# EAGLE board machine-controller (EAGLE 5.10), part 1 of 3
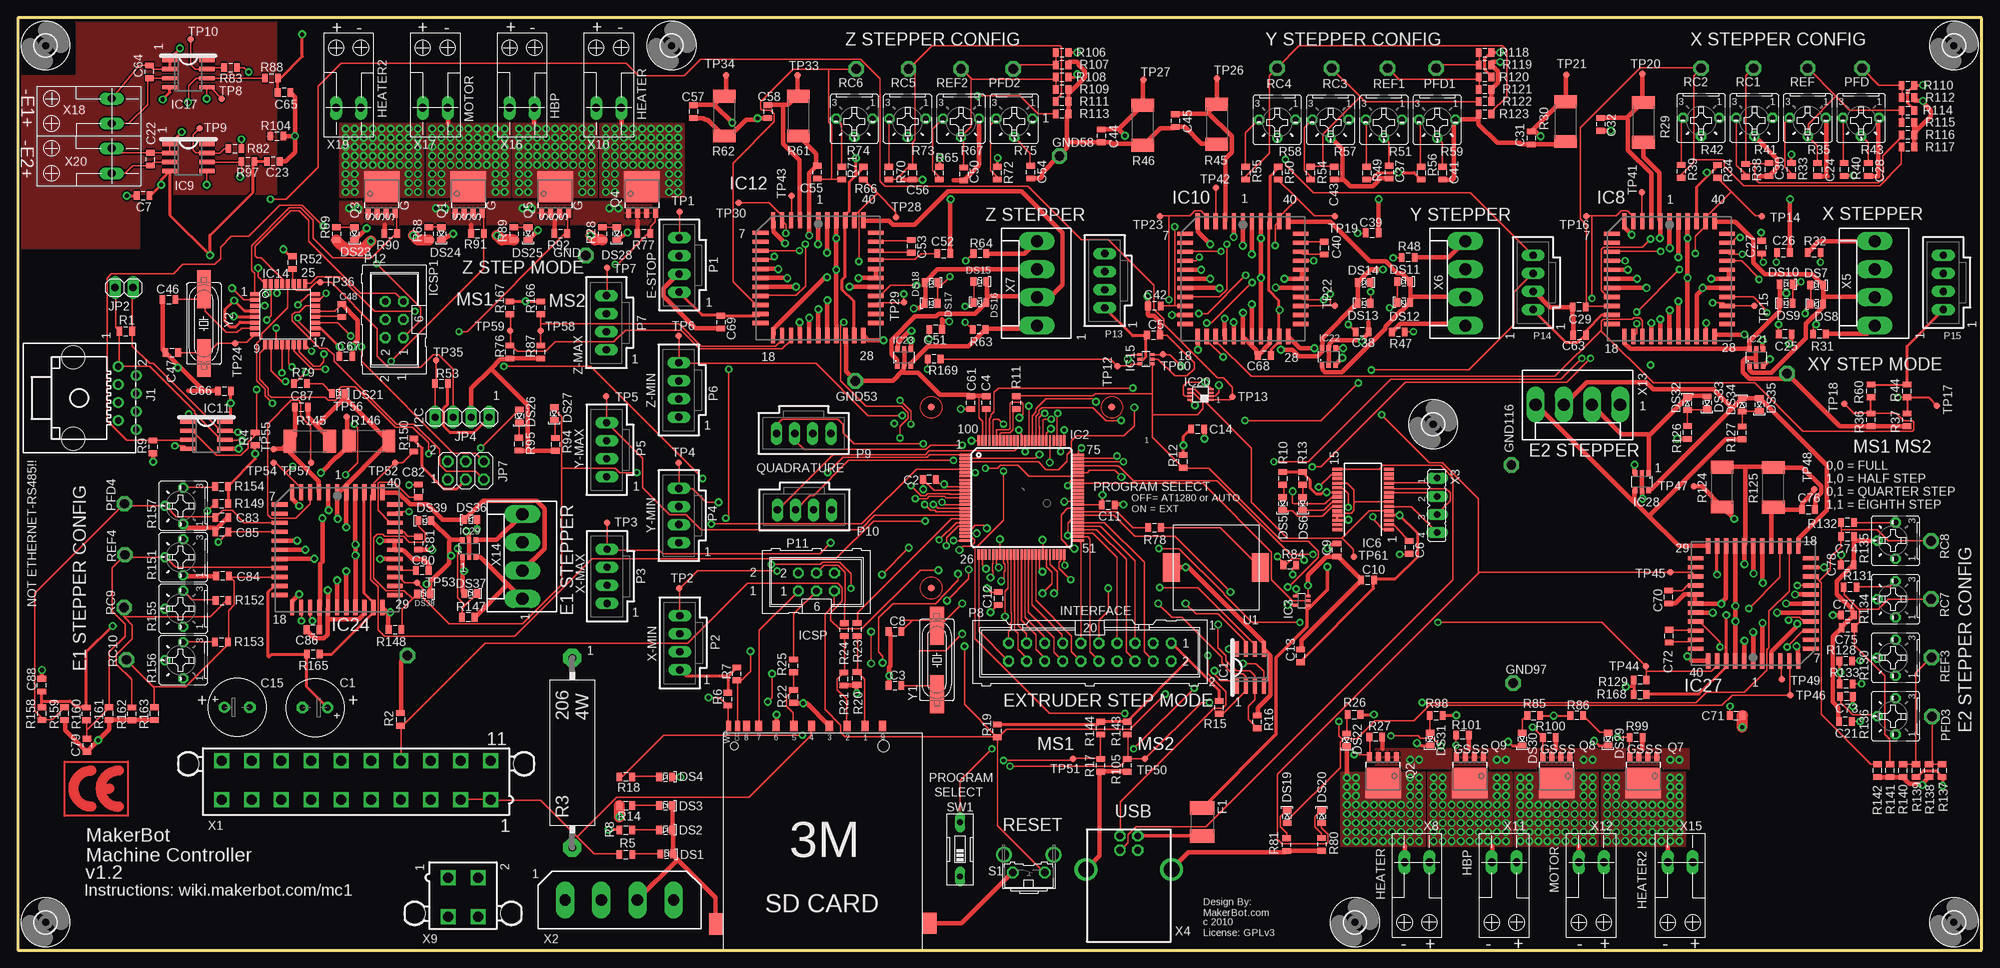
[diagram p8: board, top side]
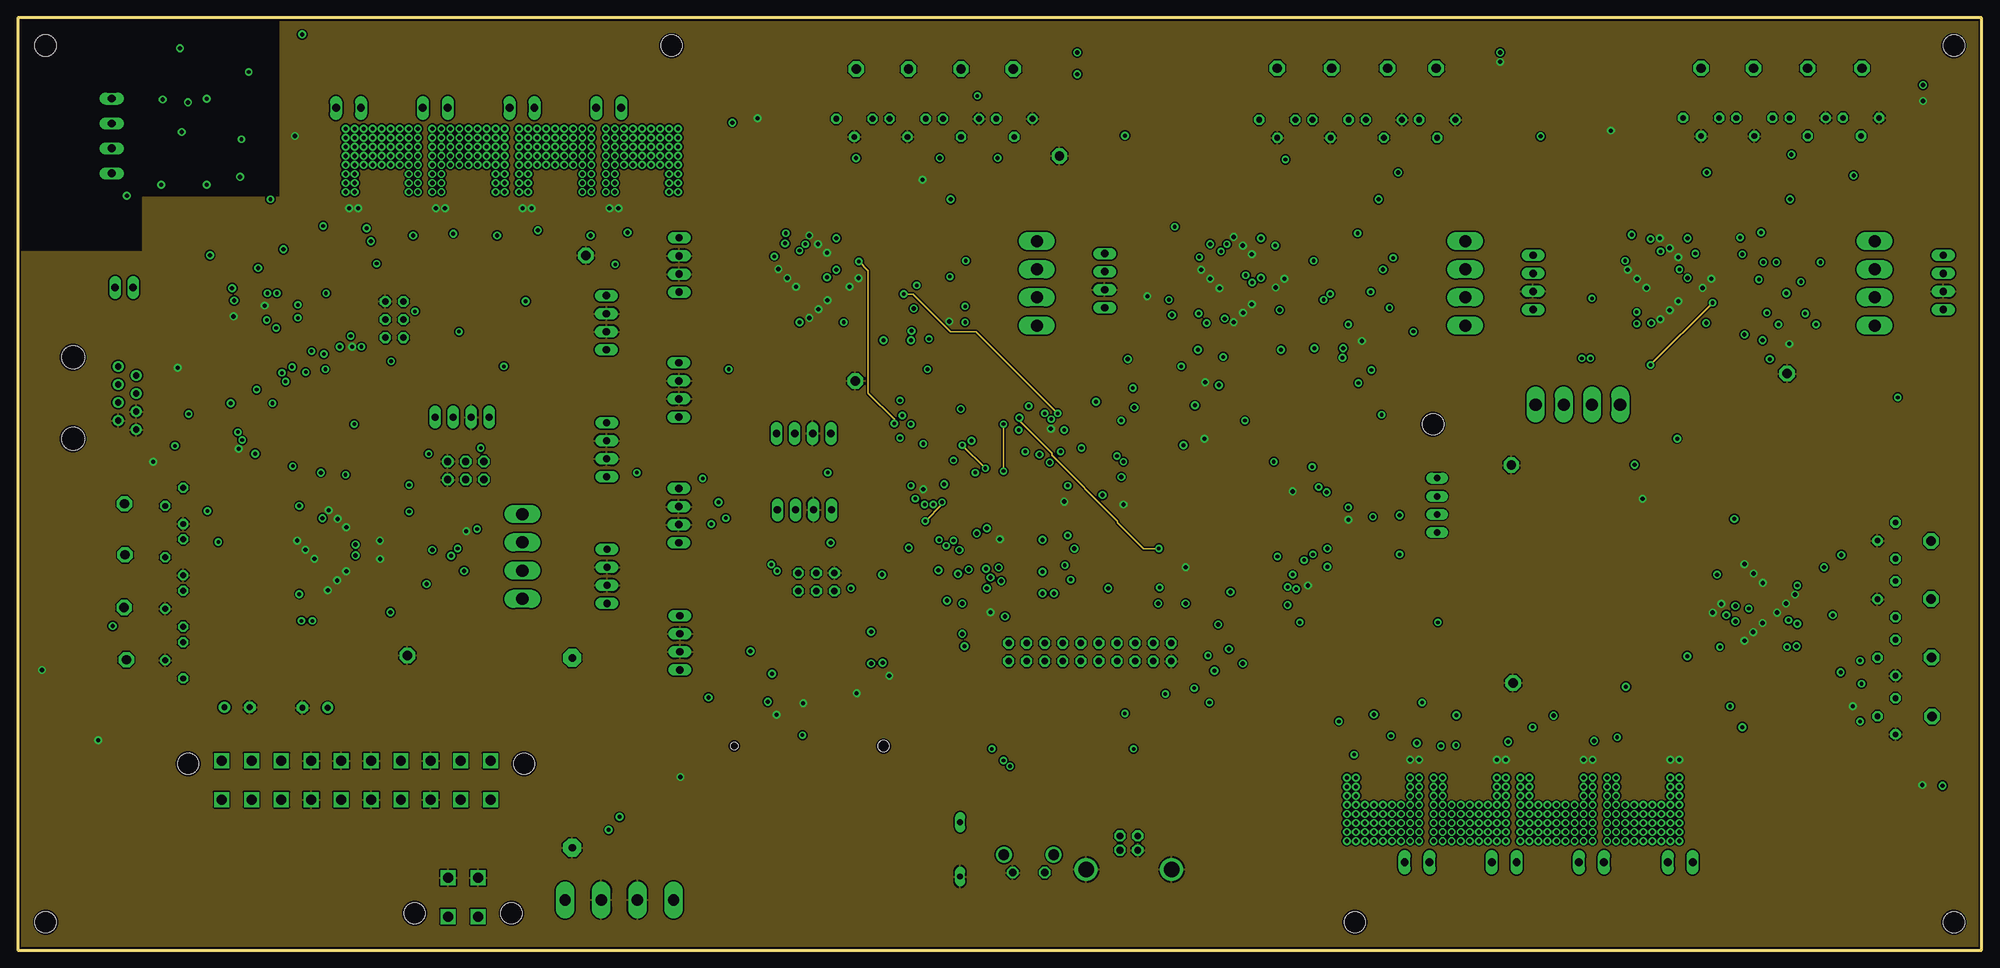
[diagram p9: board, inner layer GND]
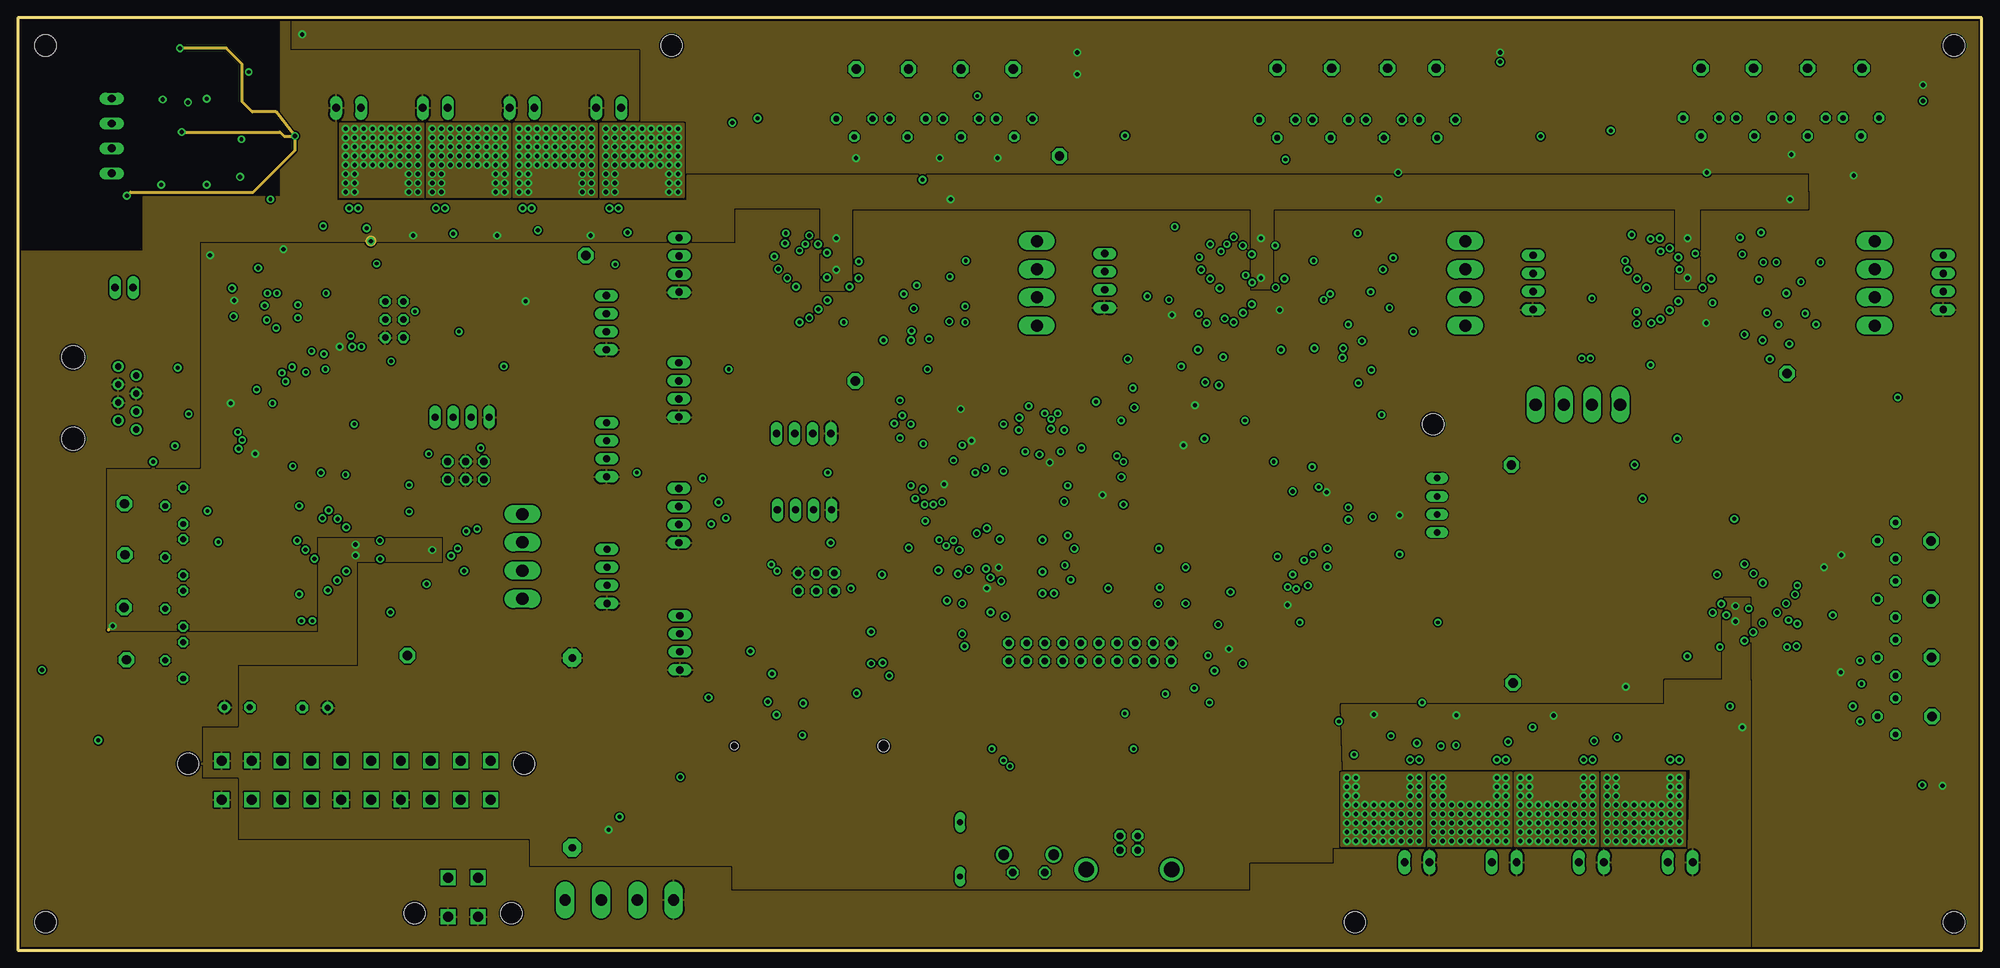
[diagram p10: board, inner layer POWER]
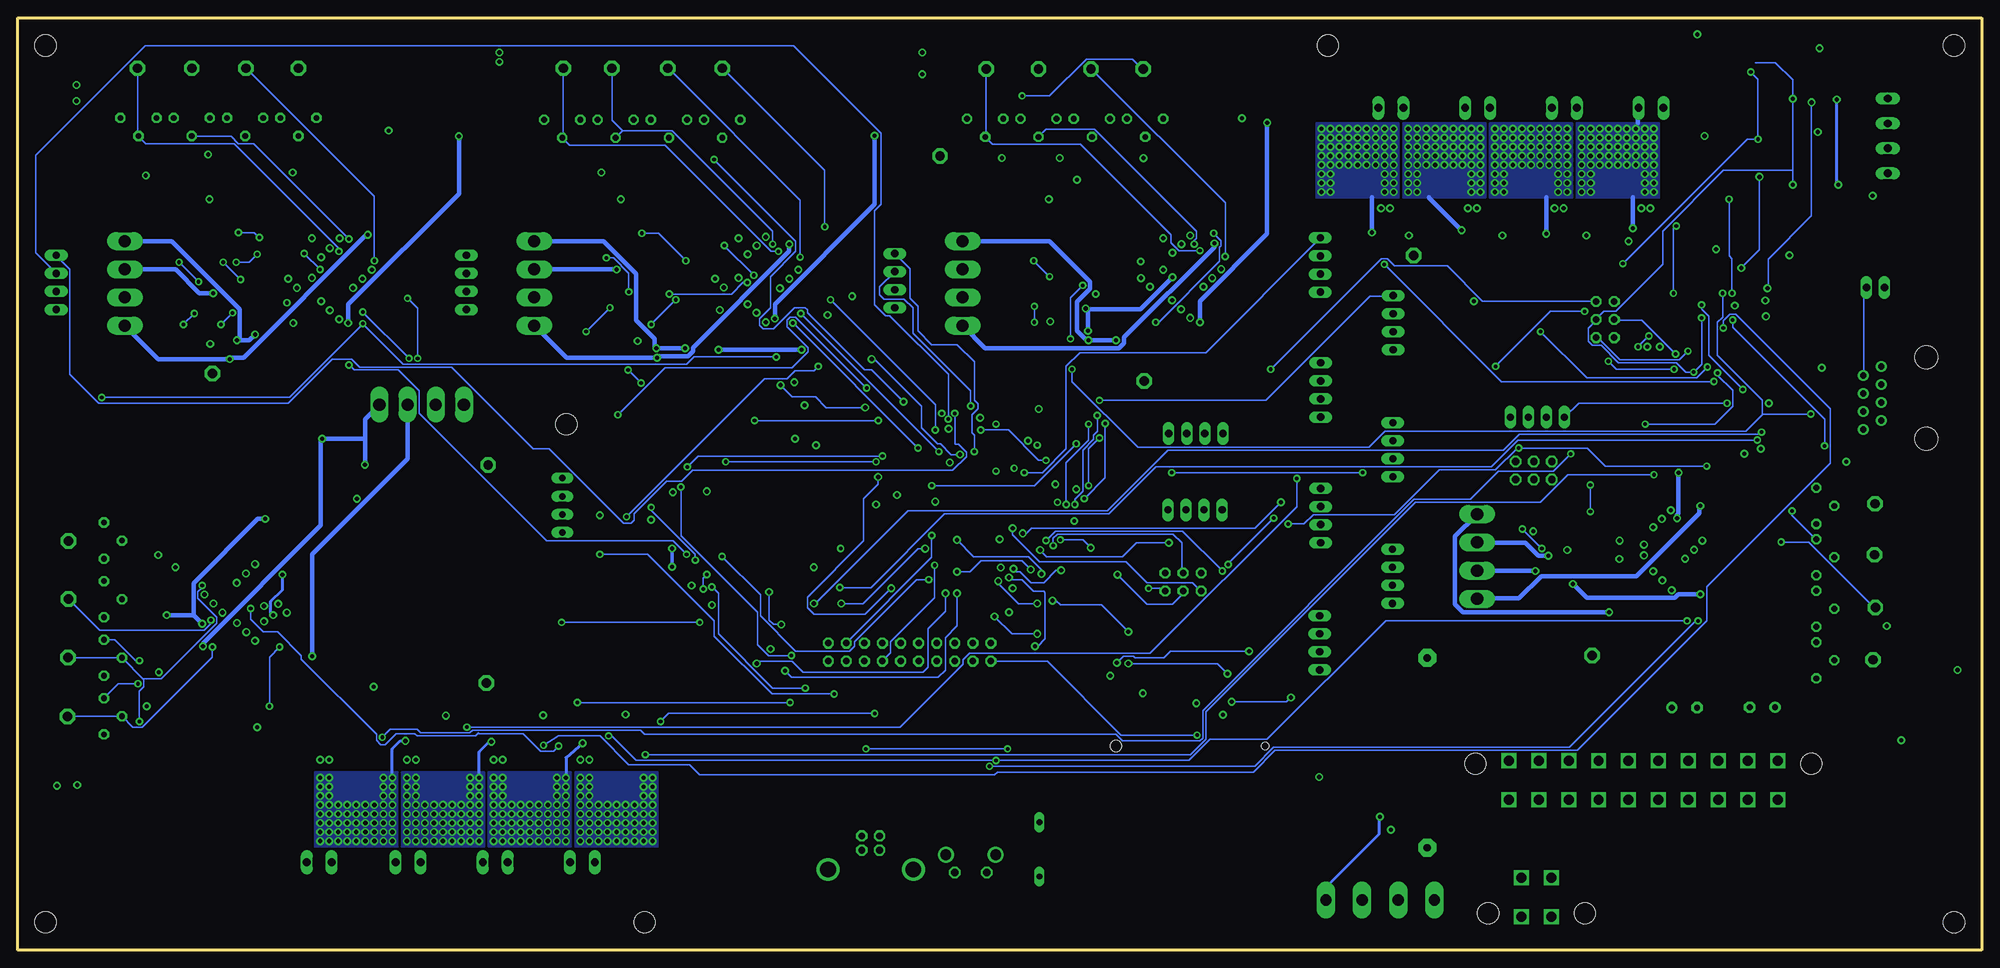
[diagram p11: board, bottom side, seen from below]

Size 276 x 131 mm. Coordinates in mm from the lower left corner, seen from the top.
Outline: 0,0 276,0 276,131 0,131 0,0
Copper layers (1*2+15*16): Top 0.035mm / dielectric 0.5mm / GND 0.035mm / dielectric 0.43mm / POWER 0.035mm / dielectric 0.5mm / Bottom 0.035mm
Design rules "SparkFun *": minimum track width 8mil, minimum drill 20mil, track to track 8mil, track to pad 8mil, pad to pad 6mil, via to via 8mil, smd to smd 6mil, copper to edge 10mil, drill to drill 8mil, minimum pad ring 12mil, minimum via ring 10mil, stop-mask expansion 3mil, vias tented up to drill 25mil, thermal gap 10mil
Net classes: 0 default: width 0.152 mm, drill 0.406 mm, clearance 0.203 mm; 1 power: width 0.61 mm, drill 0.584 mm, clearance 0.203 mm; 2 gnd: width 0.305 mm, drill 0.584 mm, clearance 0.203 mm; 3 usbvcc: width 0.508 mm, drill 0.584 mm, clearance 0.203 mm; 4 5V_power: width 0.406 mm, drill 0.584 mm, clearance 0.203 mm; 5 12V_power: width 1.524 mm, drill 0.584 mm, clearance 0.203 mm

## Footprints (pad centres in the part's own frame; a part is rotated, then mirrored left to right if it is on the bottom)
E3,5-8 = drill 0.813 pad 1.6 round: + -1.778,0 | drill 0.813 pad 1.6 octagon: - 1.778,0
0805 = smd 0.8 x 1.2: 1 -0.9,0; 2 0.9,0
LED-0805 = smd 1.2 x 0.8: A 0,-0.9; C 0,0.9
L1812 = smd 1.9 x 3.4: 1 -1.95,0; 2 1.95,0
P1-13 = drill 1.321 pad 2.159 octagon: TP 0,0
SO08 = smd 0.6 x 2.2: 1 -1.905,-2.6; 2 -0.635,-2.6; 3 0.635,-2.6; 4 1.905,-2.6; 5 1.905,2.6; 6 0.635,2.6; 7 -0.635,2.6; 8 -1.905,2.6
TQFP100 = smd 1.5 x 0.35: 1 -8,6; 2 -8,5.5; 3 -8,5; 4 -8,4.5; 5 -8,4; 6 -8,3.5; 7 -8,3; 8 -8,2.5; 9 -8,2; 10 -8,1.5; 11 -8,1; 12 -8,0.5; 13 -8,0; 14 -8,-0.5; 15 -8,-1; 16 -8,-1.5; 17 -8,-2; 18 -8,-2.5; 19 -8,-3; 20 -8,-3.5; 21 -8,-4; 22 -8,-4.5; 23 -8,-5; 24 -8,-5.5; 25 -8,-6; 51 8,-6; 52 8,-5.5; 53 8,-5; 54 8,-4.5; 55 8,-4; 56 8,-3.5; 57 8,-3; 58 8,-2.5; 59 8,-2; 60 8,-1.5; 61 8,-1; 62 8,-0.5; 63 8,0; 64 8,0.5; 65 8,1; 66 8,1.5; 67 8,2; 68 8,2.5; 69 8,3; 70 8,3.5; 71 8,4; 72 8,4.5; 73 8,5; 74 8,5.5; 75 8,6 | smd 0.35 x 1.5: 26 -6,-8; 27 -5.5,-8; 28 -5,-8; 29 -4.5,-8; 30 -4,-8; 31 -3.5,-8; 32 -3,-8; 33 -2.5,-8; 34 -2,-8; 35 -1.5,-8; 36 -1,-8; 37 -0.5,-8; 38 0,-8; 39 0.5,-8; 40 1,-8; 41 1.5,-8; 42 2,-8; 43 2.5,-8; 44 3,-8; 45 3.5,-8; 46 4,-8; 47 4.5,-8; 48 5,-8; 49 5.5,-8; 50 6,-8; 76 6,8; 77 5.5,8; 78 5,8; 79 4.5,8; 80 4,8; 81 3.5,8; 82 3,8; 83 2.5,8; 84 2,8; 85 1.5,8; 86 1,8; 87 0.5,8; 88 0,8; 89 -0.5,8; 90 -1,8; 91 -1.5,8; 92 -2,8; 93 -2.5,8; 94 -3,8; 95 -3.5,8; 96 -4,8; 97 -4.5,8; 98 -5,8; 99 -5.5,8; 100 -6,8
SC70-5 = smd 0.4 x 0.7: 1 -0.65,-0.85; 2 0,-0.85; 3 0.65,-0.85; 4 0.65,0.85; 5 -0.65,0.85
SSOP28 = smd 0.381 x 1.499: 1 -4.225,-3.625; 2 -3.575,-3.625; 3 -2.925,-3.625; 4 -2.275,-3.625; 5 -1.625,-3.625; 6 -0.975,-3.625; 7 -0.325,-3.625; 8 0.325,-3.625; 9 0.975,-3.625; 10 1.625,-3.625; 11 2.275,-3.625; 12 2.925,-3.625; 13 3.575,-3.625; 14 4.225,-3.625; 15 4.225,3.625; 16 3.575,3.625; 17 2.925,3.625; 18 2.275,3.625; 19 1.625,3.625; 20 0.975,3.625; 21 0.325,3.625; 22 -0.325,3.625; 23 -0.975,3.625; 24 -1.625,3.625; 25 -2.275,3.625; 26 -2.925,3.625; 27 -3.575,3.625; 28 -4.225,3.625
PLCC44 = smd 0.6 x 2.2: 1 0,8.1; 2 -1.27,8.1; 3 -2.54,8.1; 4 -3.81,8.1; 5 -5.08,8.1; 6 -6.35,8.1; 18 -6.35,-8.1; 19 -5.08,-8.1; 20 -3.81,-8.1; 21 -2.54,-8.1; 22 -1.27,-8.1; 23 0,-8.1; 24 1.27,-8.1; 25 2.54,-8.1; 26 3.81,-8.1; 27 5.08,-8.1; 28 6.35,-8.1; 40 6.35,8.1; 41 5.08,8.1; 42 3.81,8.1; 43 2.54,8.1; 44 1.27,8.1 | smd 2.2 x 0.6: 7 -8.1,6.35; 8 -8.1,5.08; 9 -8.1,3.81; 10 -8.1,2.54; 11 -8.1,1.27; 12 -8.1,0; 13 -8.1,-1.27; 14 -8.1,-2.54; 15 -8.1,-3.81; 16 -8.1,-5.08; 17 -8.1,-6.35; 29 8.1,-6.35; 30 8.1,-5.08; 31 8.1,-3.81; 32 8.1,-2.54; 33 8.1,-1.27; 34 8.1,0; 35 8.1,1.27; 36 8.1,2.54; 37 8.1,3.81; 38 8.1,5.08; 39 8.1,6.35
TQFP32-08 = smd 1.27 x 0.559: 1 -4.293,2.8; 2 -4.293,2; 3 -4.293,1.2; 4 -4.293,0.4; 5 -4.293,-0.4; 6 -4.293,-1.2; 7 -4.293,-2; 8 -4.293,-2.8; 17 4.293,-2.8; 18 4.293,-2; 19 4.293,-1.2; 20 4.293,-0.4; 21 4.293,0.4; 22 4.293,1.2; 23 4.293,2; 24 4.293,2.8 | smd 0.559 x 1.27: 9 -2.8,-4.293; 10 -2,-4.293; 11 -1.2,-4.293; 12 -0.4,-4.293; 13 0.4,-4.293; 14 1.2,-4.293; 15 2,-4.293; 16 2.8,-4.293; 25 2.8,4.293; 26 2,4.293; 27 1.2,4.293; 28 0.4,4.293; 29 -0.4,4.293; 30 -1.2,4.293; 31 -2,4.293; 32 -2.8,4.293
SC70-6 = smd 0.4 x 0.7: 1 -0.65,-0.85; 2 0,-0.85; 3 0.65,-0.85; 4 0.65,0.85; 5 0,0.85; 6 -0.65,0.85
DCU_R-PDSO-G8 = smd 0.3 x 0.6: 1 -0.75,-1.5; 2 -0.25,-1.5; 3 0.25,-1.5; 4 0.75,-1.5; 5 0.75,1.5; 6 0.25,1.5; 7 -0.25,1.5; 8 -0.75,1.5
SOT23-6 = smd 0.6 x 0.9: 1 -0.95,-1.15; 2 0,-1.15; 3 0.95,-1.15; 4 0.95,1.15; 5 0,1.15; 6 -0.95,1.15
556416-1 = drill 0.889 round: 1 -4.445,5.461; 2 -3.175,8.001; 3 -1.905,5.461; 4 -0.635,8.001; 5 0.635,5.461; 6 1.905,8.001; 7 3.175,5.461; 8 4.445,8.001 | hole 3.251: -5.715,-0.889; 5.715,-0.889
1X02 = drill 1.016 long: 1 -1.27,0; 2 1.27,0
1X04 = drill 1.016 long: 1 -3.81,0; 2 -1.27,0; 3 1.27,0; 4 3.81,0
2X03 = drill 1.016 octagon: 1 -2.54,-1.27; 2 -2.54,1.27; 3 0,-1.27; 4 0,1.27; 5 2.54,-1.27; 6 2.54,1.27
70543-04 = drill 1.016 long: 1 -3.81,0; 2 -1.27,0; 3 1.27,0; 4 3.81,0
ML20 = drill 0.914 octagon: 1 -11.43,-1.27; 2 -11.43,1.27; 3 -8.89,-1.27; 4 -8.89,1.27; 5 -6.35,-1.27; 6 -6.35,1.27; 7 -3.81,-1.27; 8 -3.81,1.27; 9 -1.27,-1.27; 10 -1.27,1.27; 11 1.27,-1.27; 12 1.27,1.27; 13 3.81,-1.27; 14 3.81,1.27; 15 6.35,-1.27; 16 6.35,1.27; 17 8.89,-1.27; 18 8.89,1.27; 19 11.43,-1.27; 20 11.43,1.27
ML6 = drill 0.914 octagon: 1 -2.54,-1.27; 2 -2.54,1.27; 3 0,-1.27; 4 0,1.27; 5 2.54,-1.27; 6 2.54,1.27
SOT669 = smd 0.7 x 1.4: 1 -1.905,-2.65; 2 -0.635,-2.65; 3 0.635,-2.65; 4 1.905,-2.65 | smd 5 x 4.3: MB 0,1
KH206-8 = drill 1.016 pad 2.54 octagon: 1 -13.335,0; 2 13.335,0
R2512 = smd 1.8 x 3.2: 1 -2.8,0; 2 2.8,0
B25P = drill 0.813 octagon: A -2.54,0; E 2.54,0; S 0,2.54
B3F-31XX = drill 1.016 octagon: 1 -2.261,-1.245; 2 2.261,-1.245 | drill 1.499 pad 2.159 round: 3 -3.505,1.245; 4 3.505,1.245
EDG-01 = drill 0.813 long: 1 0,-3.81; 2 0,3.81
TP09R = smd 0.9 x 0.9: TP 0,0
AUDIO12MM = smd 2.4 x 4: 1 -6.25,0; 2 6.25,0
3,0 = hole 3: 0,0
FIDUCIA-MOUNT = smd 1.016 x 1.016: P$1 0,0
3M-SDCARD = smd 1 x 1.5: 1 5.93,16.5; 2 3.43,16.5; 3 0.93,16.5; 4 -1.57,16.5; 5 -4.07,16.5; 6 -6.57,16.5; 7 -9,16.5; 8 -10.7,16.5; 9 8.43,16.5 | smd 0.7 x 1.5: CD -12,16.5; WP -13.2,16.5 | smd 2 x 3: GND1 -15,-11.3; GND2 15,-11.2 | hole 1.1: -12.427,13.705 | hole 1.6: 8.567,13.708
5566-20 = drill 1.4 square: 1 18.9,-2.75; 2 14.7,-2.75; 3 10.5,-2.75; 4 6.3,-2.75; 5 2.1,-2.75; 6 -2.1,-2.75; 7 -6.3,-2.75; 8 -10.5,-2.75; 9 -14.7,-2.75; 10 -18.9,-2.75; 11 18.9,2.75; 12 14.7,2.75; 13 10.5,2.75; 14 6.3,2.75; 15 2.1,2.75; 16 -2.1,2.75; 17 -6.3,2.75; 18 -10.5,2.75; 19 -14.7,2.75; 20 -18.9,2.75 | hole 3: 23.6,2.29; -23.6,2.29
9090-4V = drill 1.6 pad 2.6 long: 1 -7.62,0; 2 -2.54,0; 3 2.54,0; 4 7.62,0
JP4 = drill 0.914 long: 1 -3.81,0; 2 -1.27,0; 3 1.27,0; 4 3.81,0
PN61729 = drill 0.95 octagon: 1 1.25,4.71; 2 -1.25,4.71; 3 -1.25,2.71; 4 1.25,2.71 | drill 2.2 round: P$1 -6,0; P$2 6,0
KK-156-4 = drill 1.7 pad 2.184 long: 1 -5.94,0; 2 -1.98,0; 3 1.98,0; 4 5.94,0
TERMBLK3_5X2 = drill 1.1 long: 1 3.2,1.75; 2 3.2,-1.75
5566-4 = drill 1.4 square: 1 2.1,-2.75; 2 -2.1,-2.75; 3 2.1,2.75; 4 -2.1,2.75 | hole 3: 6.8,2.29; -6.8,2.29
HC49UP = smd 5.334 x 1.93: 1 -4.826,0; 2 4.826,0

## Placement (x,y rotation side)
C1  100uF  [E3,5-8]  41.77,34.08 180 top
C2  100nF  [0805]  128.11,66.13 180 top
C3  22p  [0805]  123.28,37.17 0 top
C4  100nF  [0805]  136.11,76.93 90 top
C5  100nF  [0805]  159.6,86.45 0 top
C6  100nF  [0805]  195.54,56.6 270 top
C7  100nF  [0805]  17.62,106.01 0 top
C8  22p  [0805]  123.28,44.79 0 top
C9  100nF  [0805]  185.38,56.22 90 top
C10  100nF  [0805]  189.7,52.03 0 top
C11  100nF  [0805]  153.25,62.57 0 top
C12  100nF  [0805]  137.81,49.42 270 top
C13  100nF  [0805]  180.3,41.37 90 top
C14  100nF  [0805]  165.83,73.24 0 top
C15  100uF  [E3,5-8]  30.82,34.13 0 top
C21  100nF  [0805]  256.83,32.14 180 top
C22  100nF  [0805]  18.63,111.14 90 top
C23  100nF  [0805]  35.9,110.83 180 top
C24  100nF  [0805]  252.95,109.69 270 top
C25  220nF  [0805]  248.38,86.58 180 top
C26  220nF  [0805]  248.12,98.01 0 top
C27  220nF  [0805]  245.07,98.77 270 top
C28  100nF  [0805]  260.06,109.69 90 top
C29  470pF  [0805]  219.42,90.39 180 top
C30  470pF  [0805]  246.09,109.69 270 top
C31  1uF  [0805]  212.66,114.11 270 top
C32  1uF  [0805]  222.47,116.04 270 top
C37  100nF  [0805]  192.75,109.31 270 top
C38  220nF  [0805]  188.94,86.83 180 top
C39  220nF  [0805]  190.34,100.8 0 top
C40  220nF  [0805]  183.61,98.64 270 top
C41  100nF  [0805]  200.24,109.18 90 top
C42  470pF  [0805]  159.73,90.51 180 top
C43  470pF  [0805]  185,109.18 270 top
C44  1uF  [0805]  152.29,114.42 270 top
C45  1uF  [0805]  162.65,116.55 270 top
C46  16pf  [0805]  21.25,91.43 0 top
C47  16pf  [0805]  21.65,83.96 0 top
C48  100nF  [0805]  45.56,89.88 270 top
C50  100nF  [0805]  132.93,109.06 270 top
C51  220nF  [0805]  129,87.21 180 top
C52  220nF  [0805]  130.14,97.88 0 top
C53  220nF  [0805]  125.57,98.9 270 top
C54  100nF  [0805]  142.33,109.31 90 top
C55  470pF  [0805]  112.36,109.31 90 top
C56  470pF  [0805]  125.69,109.18 270 top
C57  1uF  [0805]  94.96,117.82 270 top
C58  1uF  [0805]  105.37,117.82 270 top
C61  100nF  [0805]  133.95,76.93 90 top
C63  100nF  [0805]  219.5,86.4 180 top
C64  100nF  [0805]  18.5,123.41 90 top
C65  100nF  [0805]  37.43,120.49 180 top
C66  100nF  [0805]  29.05,78.58 0 top
C67  100nF  [0805]  46.11,83.4 180 top
C68  100nF  [0805]  175.2,83.55 180 top
C69  100nF  [0805]  98.79,88.23 270 top
C70  220nF  [0805]  231.99,49.62 90 top
C71  220nF  [0805]  241.49,32.96 0 top
C72  220nF  [0805]  232.04,44.13 90 top
C73  100nF  [0805]  256.99,35.65 180 top
C74  470pF  [0805]  257.14,58.1 0 top
C75  470pF  [0805]  257.19,45.3 180 top
C76  1uF  [0805]  251.65,61.91 0 top
C77  1uF  [0805]  257.14,47.08 0 top
C78  100nF  [0805]  257.09,54.14 0 top
C79  100nF  [0805]  9.72,28.79 270 top
C80  220nF  [0805]  56.83,53.33 180 top
C81  220nF  [0805]  56.33,57.19 270 top
C82  220nF  [0805]  56.33,64.53 270 top
C83  100nF  [0805]  28.69,60.82 180 top
C84  470pF  [0805]  28.79,52.57 180 top
C85  470pF  [0805]  28.69,58.74 180 top
C86  1uF  [0805]  41.49,45.02 180 top
C87  1uF  [0805]  39.87,76.32 0 top
C88  100nF  [0805]  3.37,37.22 90 top
DS1  3-3V  [LED-0805]  91.18,13.49 270 top
DS2  5V  [LED-0805]  91.04,16.91 270 top
DS3  12V  [LED-0805]  91.04,20.31 270 top
DS4  DEBUG  [LED-0805]  91.02,24.35 270 top
DS5  RX  [LED-0805]  177.74,62.73 180 top
DS6  TX  [LED-0805]  180.58,62.73 180 top
DS7  LED2_A  [LED-0805]  252.82,93.44 270 top
DS8  LED3_B  [LED-0805]  252.82,90.77 90 top
DS9  LED4_C  [LED-0805]  248.5,90.9 90 top
DS10  LED5_D  [LED-0805]  248.5,93.56 270 top
DS11  LED1_A  [LED-0805]  194.78,93.94 270 top
DS12  LED6_B  [LED-0805]  194.78,91.02 90 top
DS13  LED7_C  [LED-0805]  189.19,90.9 90 top
DS14  LED8_D  [LED-0805]  189.19,93.82 270 top
DS15  LED9_A  [LED-0805]  135.22,93.94 270 top
DS16  LED10_B  [LED-0805]  135.22,91.02 90 top
DS17  LED11_C  [LED-0805]  128.36,90.9 90 top
DS18  LED12_D  [LED-0805]  128.36,93.82 270 top
DS19  DIR1  [LED-0805]  178.37,18.76 0 top
DS20  SPEED1  [LED-0805]  183.22,18.76 0 top
DS21  EXT_DBG  [LED-0805]  45.05,78.2 270 top
DS22  D2  [LED-0805]  186.78,29.55 180 top
DS23  A1  [LED-0805]  47.33,100.67 180 top
DS24  B1  [LED-0805]  59.53,100.67 180 top
DS25  C1  [LED-0805]  71.72,100.67 180 top
DS26  DIR2  [LED-0805]  70.47,75.05 180 top
DS27  SPEED2  [LED-0805]  75.38,75.38 180 top
DS28  D1  [LED-0805]  84.16,100.67 180 top
DS29  A2  [LED-0805]  223.48,29.66 180 top
DS30  B2  [LED-0805]  211.42,29.66 180 top
DS31  C2  [LED-0805]  198.46,29.66 180 top
DS32  LED13_A  [LED-0805]  234.63,76.8 0 top
DS33  LED14_B  [LED-0805]  237.38,76.9 180 top
DS34  LED15_C  [LED-0805]  242.3,76.59 0 top
DS35  LED16_D  [LED-0805]  244.74,76.65 180 top
DS36  LED13_A  [LED-0805]  63.67,60.49 90 top
DS37  LED14_B  [LED-0805]  63.64,50.1 270 top
DS38  LED15_C  [LED-0805]  57.04,50.03 270 top
DS39  LED16_D  [LED-0805]  57.19,60.34 90 top
F1  500mA  [L1812]  166.46,18 270 top
GND  TPPAD1-13  [P1-13]  79.85,97.63 0 top
GND53  TPPAD1-13  [P1-13]  117.69,79.97 0 top
GND58  TPPAD1-13  [P1-13]  146.39,111.6 0 top
GND96  TPPAD1-13  [P1-13]  248.65,81.01 0 top
GND97  TPPAD1-13  [P1-13]  210.12,37.55 0 top
GND116  TPPAD1-13  [P1-13]  209.89,68.16 0 top
GND125  TPPAD1-13  [P1-13]  54.75,41.42 180 top
IC1  SN75176A  [SO08]  173.24,39.7 0 top
IC2  ATMEGA1280-16AU  [TQFP100]  141.06,63.59 0 top
IC3  74LVC1G32DCK  [SC70-5]  180.43,49.11 90 top
IC6  FT232RL  [SSOP28]  189.07,63.34 90 top
IC8  A3977  [PLCC44]  232.12,94.32 0 top
IC9  MAX6675  [SO08]  23.97,111.37 270 top
IC10  A3977  [PLCC44]  172.18,94.32 0 top
IC11  SN75176ASOIC  [SO08]  26.51,72.35 270 top
IC12  A3977  [PLCC44]  112.48,94.45 0 top
IC14  ATMEGA328  [TQFP32-08]  37.55,89.37 0 top
IC15  74LVC1G19  [SC70-6]  158.54,83.05 90 top
IC17  MAX6675  [SO08]  23.97,123.15 270 top
IC20  74LVC2G157  [DCU_R-PDSO-G8]  166.21,78.07 90 top
IC21  SMS-12  [SOT23-6]  244.31,83.28 0 top
IC22  SMS-12  [SOT23-6]  184.24,83.4 0 top
IC23  SMS-12  [SOT23-6]  124.55,83.28 0 top
IC24  A3977  [PLCC44]  44.9,56.25 0 top
IC27  A3977  [PLCC44]  243.88,48.71 180 top
IC28  SMS-12  [SOT23-6]  228.23,65.83 180 top
IC29  TVS-DIODE-ARRAY  [SOT23-6]  63.44,56.43 0 top
J1  [556416-1]  8.65,77.58 270 top
JP2  [1X02]  14.93,93.09 180 top
JP4  [1X04]  62.45,74.89 180 top
JP7  [2X03]  62.95,67.4 0 top
P1  C-GRID-04-70543  [70543-04]  92.95,96.27 90 top
P2  C-GRID-04-70543  [70543-04]  93.05,43.18 90 top
P3  C-GRID-04-70543  [70543-04]  82.81,52.53 90 top
P4  C-GRID-04-70543  [70543-04]  92.9,61.06 90 top
P5  C-GRID-04-70543  [70543-04]  82.76,70.31 90 top
P6  C-GRID-04-70543  [70543-04]  92.91,78.71 90 top
P7  C-GRID-04-70543  [70543-04]  82.72,88.16 90 top
P8  [ML20]  150.67,41.88 180 top
P9  C-GRID-04-70543  [70543-04]  110.45,72.61 180 top
P10  C-GRID-04-70543  [70543-04]  110.55,61.86 180 top
P11  [ML6]  112.23,51.73 0 top
P12  [ML6]  52.92,88.61 90 top
P13  C-GRID-04-70543  [70543-04]  152.74,94.07 90 top
P14  C-GRID-04-70543  [70543-04]  212.94,93.82 90 top
P15  C-GRID-04-70543  [70543-04]  270.6,93.82 90 top
PFD  TPPAD1-13  [P1-13]  259.17,123.92 180 top
PFD1  TPPAD1-13  [P1-13]  199.35,123.92 0 top
PFD2  TPPAD1-13  [P1-13]  139.92,123.79 180 top
PFD3  TPPAD1-13  [P1-13]  269.03,32.86 270 top
PFD4  TPPAD1-13  [P1-13]  15,62.73 90 top
Q1  PH7030L  [SOT669]  63.34,106.26 0 top
Q2  PH7030L  [SOT669]  191.86,24.47 180 top
Q3  PH7030L  [SOT669]  51.14,106.26 0 top
Q4  PH7030L  [SOT669]  87.72,106.26 0 top
Q5  PH7030L  [SOT669]  75.53,106.26 0 top
Q7  PH7030L  [SOT669]  228.44,24.47 180 top
Q8  PH7030L  [SOT669]  216.24,24.47 180 top
Q9  PH7030L  [SOT669]  204.05,24.47 180 top
R1  180  [0805]  15.18,86.96 0 top
R2  1K  [0805]  53.8,32.43 270 top
R3  30  [KH206-8]  77.93,27.73 90 top
R4  4.7k  [0805]  33.36,71.84 270 top
R5  1K  [0805]  85.45,13.47 0 top
R6  10K  [0805]  99.79,35.27 90 top
R7  10K  [0805]  101.06,38.82 90 top
R8  1K  [0805]  85.43,16.85 0 top
R9  4.7k  [0805]  19.01,70.73 270 top
R10  1K  [0805]  177.74,66.28 270 top
R11  1K  [0805]  140.35,76.93 270 top
R12  10K  [0805]  163.79,68.67 90 top
R13  1K  [0805]  180.58,66.28 270 top
R14  3.3K  [0805]  85.44,20.32 0 top
R15  10K  [0805]  168.83,34.11 90 top
R16  10K  [0805]  174.21,32.08 90 top
R17  10K  [0805]  152.21,25.98 90 top
R18  1K  [0805]  85.43,24.35 180 top
R19  10K  [0805]  137.63,30.82 90 top
R20  330  [0805]  117.95,38.19 90 top
R21  330  [0805]  116.11,38.09 90 top
R22  330  [0805]  109.02,35.65 90 top
R23  180  [0805]  117.95,45.05 90 top
R24  180  [0805]  116.16,45.03 90 top
R25  180  [0805]  109.02,39.95 90 top
R26  1K  [0805]  187.8,33.11 0 top
R27  4.7K  [0805]  190.84,29.93 180 top
R28  1K  [0805]  82.13,100.67 270 top
R29  0.25  [R2512]  228.44,116.3 270 top
R30  0.25  [R2512]  217.51,116.42 270 top
R31  1K  [0805]  253.2,86.58 180 top
R32  1K  [0805]  252.44,98.01 0 top
R33  12K  [0805]  249.26,109.69 90 top
R34  1K  [0805]  238.85,109.44 90 top
R35  47K  [B25P]  251.55,116.93 180 top
R36  10K  [0805]  260.44,74.51 90 top
R37  10K  [0805]  265.52,74.51 90 top
R38  12K  [0805]  242.79,109.56 90 top
R39  12K  [0805]  233.77,109.44 270 top
R40  12K  [0805]  256.63,109.69 270 top
R41  47K  [B25P]  244.06,116.93 180 top
R42  47K  [B25P]  236.56,116.93 180 top
R43  47K  [B25P]  259.04,116.93 180 top
R44  0  [0805]  265.52,78.58 90 top
R45  0.25  [R2512]  168.49,116.04 270 top
R46  0.25  [R2512]  158.08,115.91 270 top
R47  1K  [0805]  194.02,86.83 0 top
R48  1K  [0805]  195.39,97.32 180 top
R49  12K  [0805]  189.57,109.18 270 top
R50  1K  [0805]  177.13,109.18 90 top
R51  47K  [B25P]  191.99,116.68 180 top
R52  4.7K  [0805]  38.57,96.61 90 top
R53  4.7K  [0805]  59.53,79.59 0 top
R54  12K  [0805]  181.7,109.18 90 top
R55  12K  [0805]  172.56,109.18 270 top
R56  12K  [0805]  197.19,109.18 270 top
R57  47K  [B25P]  184.49,116.68 180 top
R58  47K  [B25P]  177,116.68 180 top
R59  47K  [B25P]  199.48,116.68 180 top
R60  0  [0805]  260.44,78.58 90 top
R61  0.25  [R2512]  109.69,117.18 270 top
R62  0.25  [R2512]  99.28,117.18 270 top
R63  1K  [0805]  135.09,87.21 180 top
R64  1K  [0805]  135.22,97.88 180 top
R65  12K  [0805]  129.5,109.18 90 top
R66  1K  [0805]  118.84,109.18 90 top
R67  47K  [B25P]  132.55,116.8 180 top
R68  1K  [0805]  57.75,100.67 270 top
R69  1K  [0805]  44.79,100.67 270 top
R70  12K  [0805]  122.39,109.18 270 top
R71  12K  [0805]  115.79,109.18 270 top
R72  12K  [0805]  137.63,109.18 90 top
R73  47K  [B25P]  125.06,116.8 180 top
R74  47K  [B25P]  117.57,116.8 180 top
R75  47K  [B25P]  140.04,116.8 180 top
R76  10K  [0805]  69.18,84.04 90 top
R77  4.7K  [0805]  87.97,100.67 0 top
R78  1K  [0805]  159.75,59.37 0 top
R79  1K  [0805]  39.71,79.59 180 top
R80  1K  [0805]  183.22,14.87 270 top
R81  1K  [0805]  178.35,14.82 90 top
R82  180  [0805]  30.52,112.61 0 top
R83  180  [0805]  29.91,123.99 0 top
R84  1K  [0805]  178.75,54.09 180 top
R85  1K  [0805]  213.04,32.96 0 top
R86  1K  [0805]  219.09,32.96 180 top
R87  10K  [0805]  73.5,84.04 90 top
R88  10K  [0805]  35.65,122.52 0 top
R89  1K  [0805]  69.69,100.67 270 top
R90  4.7K  [0805]  52.41,100.67 0 top
R91  4.7K  [0805]  64.61,100.67 0 top
R92  4.7K  [0805]  76.29,100.67 0 top
R94  1K  [0805]  75.53,71.06 270 top
R95  1K  [0805]  70.45,71.11 90 top
R97  10K  [0805]  32.35,110.83 0 top
R98  1K  [0805]  199.33,32.98 0 top
R99  4.7K  [0805]  227.42,29.91 180 top
R100  4.7K  [0805]  215.23,29.91 180 top
R101  4.7K  [0805]  203.04,30.21 180 top
R104  0  [0805]  36.41,114.39 0 top
R105  10K  [0805]  155.92,25.97 90 top
R106  12K  [0805]  146.75,126.12 0 top
R107  12K  [0805]  146.75,124.4 180 top
R108  12K  [0805]  146.75,122.67 0 top
R109  12K  [0805]  146.75,120.94 180 top
R110  12K  [0805]  265.62,121.5 0 top
R111  12K  [0805]  146.75,119.22 180 top
R112  12K  [0805]  265.62,119.77 180 top
R113  12K  [0805]  146.75,117.49 180 top
R114  12K  [0805]  265.62,118 0 top
R115  12K  [0805]  265.62,116.28 180 top
R116  12K  [0805]  265.62,114.54 180 top
R117  12K  [0805]  265.62,112.82 180 top
R118  12K  [0805]  206.19,126.12 0 top
R119  12K  [0805]  206.19,124.4 180 top
R120  12K  [0805]  206.19,122.67 0 top
R121  12K  [0805]  206.19,120.94 180 top
R122  12K  [0805]  206.19,119.22 180 top
R123  12K  [0805]  206.19,117.49 0 top
R124  0.25  [R2512]  239.51,65.06 90 top
R125  0.25  [R2512]  246.72,65.01 90 top
R126  1K  [0805]  234.63,72.73 90 top
R127  1K  [0805]  242.3,72.68 90 top
R128  12K  [0805]  256.88,40.63 180 top
R129  1K  [0805]  227.98,37.94 180 top
R130  47K  [B25P]  263.89,41.09 90 top
R131  12K  [0805]  257.49,50.99 180 top
R132  12K  [0805]  257.14,60.08 180 top
R133  12K  [0805]  256.93,37.43 180 top
R134  47K  [B25P]  263.89,49.32 90 top
R135  47K  [B25P]  263.89,57.54 90 top
R136  47K  [B25P]  263.89,32.86 90 top
R137  12K  [0805]  270.45,25.24 270 top
R138  12K  [0805]  268.62,25.24 90 top
R139  12K  [0805]  266.79,25.24 270 top
R140  12K  [0805]  264.91,25.24 90 top
R141  12K  [0805]  263.13,25.24 90 top
R142  12K  [0805]  261.35,25.24 90 top
R143  0  [0805]  155.92,31.2 90 top
R144  0  [0805]  152.21,31.19 90 top
R145  0.25  [R2512]  41.03,71.51 0 top
R146  0.25  [R2512]  49.35,71.55 0 top
R147  1K  [0805]  63.31,46.78 180 top
R148  1K  [0805]  53.02,45.07 0 top
R149  12K  [0805]  28.66,62.73 0 top
R150  1K  [0805]  55.69,70.98 90 top
R151  47K  [B25P]  23.25,55.21 90 top
R152  12K  [0805]  28.72,49.14 0 top
R153  12K  [0805]  28.61,43.3 0 top
R154  12K  [0805]  28.64,65.14 0 top
R155  47K  [B25P]  23.25,47.97 90 top
R156  47K  [B25P]  23.25,40.72 90 top
R157  47K  [B25P]  23.25,62.42 90 top
R158  12K  [0805]  3.39,33.24 90 top
R159  12K  [0805]  6.57,33.24 90 top
R160  12K  [0805]  9.67,33.21 90 top
R161  12K  [0805]  12.84,33.24 90 top
R162  12K  [0805]  16.03,33.21 90 top
R163  12K  [0805]  19.19,33.23 90 top
R165  1K  [0805]  41.52,41.59 0 top
R166  0  [0805]  73.5,90.26 90 top
R167  0  [0805]  69.18,90.26 90 top
R168  1K  [0805]  227.98,35.95 0 top
R169  1K  [0805]  128.77,83.05 180 top
RC1  TPPAD1-13  [P1-13]  243.93,123.92 180 top
RC2  TPPAD1-13  [P1-13]  236.56,123.92 180 top
RC3  TPPAD1-13  [P1-13]  184.62,123.92 0 top
RC4  TPPAD1-13  [P1-13]  177,123.92 0 top
RC5  TPPAD1-13  [P1-13]  125.19,123.79 180 top
RC6  TPPAD1-13  [P1-13]  117.82,123.79 180 top
RC7  TPPAD1-13  [P1-13]  268.87,49.32 270 top
RC8  TPPAD1-13  [P1-13]  268.87,57.49 270 top
RC9  TPPAD1-13  [P1-13]  14.95,48.12 90 top
RC10  TPPAD1-13  [P1-13]  15.25,40.81 90 top
REF  TPPAD1-13  [P1-13]  251.55,123.92 180 top
REF1  TPPAD1-13  [P1-13]  192.5,123.92 0 top
REF2  TPPAD1-13  [P1-13]  132.55,123.79 180 top
REF3  TPPAD1-13  [P1-13]  268.92,41.14 270 top
REF4  TPPAD1-13  [P1-13]  15.08,55.56 90 top
S1  [B3F-31XX]  142.08,12.16 0 top
SW1  [EDG-01]  132.42,14.16 0 top
TP1  TPSQTP09R  [TP09R]  92.97,103.76 0 top
TP2  TPSQTP09R  [TP09R]  92.96,50.85 0 top
TP3  TPSQTP09R  [TP09R]  82.84,60.02 180 top
TP4  TPSQTP09R  [TP09R]  92.9,68.51 180 top
TP5  TPSQTP09R  [TP09R]  82.69,77.85 180 top
TP6  TPSQTP09R  [TP09R]  92.85,86.34 180 top
TP7  TPSQTP09R  [TP09R]  82.85,95.91 0 top
TP8  PTR1TP09R  [TP09R]  28.69,119.62 0 top
TP9  PTR1TP09R  [TP09R]  25.54,115.46 0 top
TP10  PTR1TP09R  [TP09R]  24.32,127.95 0 top
TP12  TPSQTP09R  [TP09R]  154.57,82.03 0 top
TP13  TPSQTP09R  [TP09R]  170.73,77.76 0 top
TP14  PTR1TP09R  [TP09R]  245.07,103.09 90 top
TP15  PTR1TP09R  [TP09R]  244.06,90.51 90 top
TP16  PTR1TP09R  [TP09R]  220.44,103.09 180 top
TP17  PTR1TP09R  [TP09R]  269.71,76.49 90 top
TP18  PTR1TP09R  [TP09R]  256.66,76.77 90 top
TP19  PTR1TP09R  [TP09R]  185.13,103.09 180 top
TP20  PTR1TP09R  [TP09R]  228.31,123.15 0 top
TP21  PTR1TP09R  [TP09R]  217.64,123.03 90 top
TP22  PTR1TP09R  [TP09R]  185.13,90.51 90 top
TP23  PTR1TP09R  [TP09R]  160.49,103.09 180 top
TP24  PTR1TP09R  [TP09R]  30.57,85.31 180 top
TP26  PTR1TP09R  [TP09R]  168.49,122.52 0 top
TP27  PTR1TP09R  [TP09R]  158.21,122.26 0 top
TP28  PTR1TP09R  [TP09R]  123.41,102.96 0 top
TP29  PTR1TP09R  [TP09R]  124.55,91.02 90 top
TP30  PTR1TP09R  [TP09R]  101.31,104.99 180 top
TP33  PTR1TP09R  [TP09R]  109.56,122.9 0 top
TP34  PTR1TP09R  [TP09R]  99.53,122.9 180 top
TP35  PTR1TP09R  [TP09R]  58.76,82.89 0 top
TP36  PTR1TP09R  [TP09R]  42.51,93.82 0 top
TP41  PTR1TP09R  [TP09R]  228.23,106.52 90 top
TP42  PTR1TP09R  [TP09R]  168.39,107.13 0 top
TP43  PTR1TP09R  [TP09R]  108.75,106.01 0 top
TP44  PTR1TP09R  [TP09R]  228.79,39.92 0 top
TP45  PTR1TP09R  [TP09R]  232.25,53.07 180 top
TP46  PTR1TP09R  [TP09R]  249.11,35.8 0 top
TP47  PTR1TP09R  [TP09R]  235.55,65.22 180 top
TP48  PTR1TP09R  [TP09R]  252.46,64.76 90 top
TP49  PTR1TP09R  [TP09R]  247.89,38.04 180 top
TP50  PTR1TP09R  [TP09R]  158.43,26.86 0 top
TP51  PTR1TP09R  [TP09R]  148.27,26.91 0 top
TP52  PTR1TP09R  [TP09R]  53.02,68.49 180 top
TP53  PTR1TP09R  [TP09R]  56.1,51.6 180 top
TP54  PTR1TP09R  [TP09R]  35.93,68.49 180 top
TP55  PTR1TP09R  [TP09R]  35.98,70.4 90 top
TP56  PTR1TP09R  [TP09R]  46.24,74.92 270 top
TP57  PTR1TP09R  [TP09R]  41.26,68.49 180 top
TP58  PTR1TP09R  [TP09R]  73.5,87.01 0 top
TP59  PTR1TP09R  [TP09R]  69.18,87.03 0 top
TP60  TPSQTP09R  [TP09R]  160.92,83.71 0 top
TP61  TPSQTP09R  [TP09R]  187.77,55.26 0 top
U1  PIEZO12MM  [AUDIO12MM]  168.39,53.79 180 top
U$1  [3,0]  187.9,3.9 0 top
U$2  [3,0]  198.9,73.9 0 top
U$3  FIDUCIALMOUNT  [FIDUCIA-MOUNT]  128.36,50.89 0 top
U$4  [3,0]  3.9,127.1 0 top
U$5  [3,0]  272.1,127.1 0 top
U$6  [3,0]  272.1,3.9 0 top
U$7  [3,0]  3.9,3.9 0 top
U$8  FIDUCIALMOUNT  [FIDUCIA-MOUNT]  153.76,76.29 0 top
U$9  FIDUCIALMOUNT  [FIDUCIA-MOUNT]  128.36,76.29 0 top
U$10  CE  [CE-COPPER]  6.57,18.89 0 top
U$11  [3,0]  91.9,127.1 0 top
U$13  SDCARD  [3M-SDCARD]  113.12,14.97 0 top
X1  5566-20  [5566-20]  47.54,23.89 0 top
X2  9090-4V  [9090-4V]  84.55,7.07 0 top
X3  [JP4]  199.45,62.5 270 top
X4  [PN61729]  156.14,11.34 0 top
X5  [KK-156-4]  260.95,93.69 90 top
X6  [KK-156-4]  203.42,93.69 90 top
X7  [KK-156-4]  143.22,93.69 90 top
X8  TERMBLK3_5X2  [TERMBLK3_5X2]  196.65,9.15 90 top
X9  5566-4  [5566-4]  62.57,7.46 180 top
X10  TERMBLK3_5X2  [TERMBLK3_5X2]  83.04,121.54 270 top
X11  TERMBLK3_5X2  [TERMBLK3_5X2]  208.9,9.15 90 top
X12  TERMBLK3_5X2  [TERMBLK3_5X2]  221.15,9.15 90 top
X13  [KK-156-4]  219.24,76.65 180 top
X14  [KK-156-4]  70.91,55.31 90 top
X15  TERMBLK3_5X2  [TERMBLK3_5X2]  233.65,9.15 90 top
X16  TERMBLK3_5X2  [TERMBLK3_5X2]  70.85,121.54 270 top
X17  TERMBLK3_5X2  [TERMBLK3_5X2]  58.66,121.54 270 top
X18  TERMBLK3_5X2  [TERMBLK3_5X2]  10,117.9 0 top
X19  TERMBLK3_5X2  [TERMBLK3_5X2]  46.47,121.54 270 top
X20  TERMBLK3_5X2  [TERMBLK3_5X2]  10,110.9 0 top
Y1  [HC49UP]  129.17,40.78 90 top
Y2  [HC49UP]  26.15,88.02 90 top

## Tracks (layer width: path | path; a pad name or v marks a point on that pad's centre or on a via)
!USB_RST  (via drill 0.51)
  Top 0.203: v180.79,54.8 180.58,55 179.06,55 178.14,54.09 R84.2 178.14,54.19 v177.03,55.31 | v186.98,62.22 186.98,64.15 186.27,64.86 185.46,64.86 IC6.19 | v147.97,52.06 146.34,53.68 146.34,54.5 146.55,54.7 146.55,55.51 IC2.49
  Bottom 0.203: v180.79,54.8 180.79,55.61 186.98,61.81 v186.98,62.22 | v147.97,52.06 149.7,52.06 158.43,43.32 158.43,42.71 159.15,42 166.66,42 171.64,46.98 171.64,49.92 v177.03,55.31
+5V  (via drill 0.58, 0.6, 0.6 pad 0)
  Top 0.203: IC2.10 130.05,65.09 129.93,65.21 C2.1 | IC2.31 137.56,54.03 v137.86,53.76 | C12.1 136.71,50.32 v136.18,50.84 | IC2.61 152.34,62.59 C11.1 | IC2.100 134.07,71.59 v134.05,71.57 | IC2.80 145.06,68.56 v145.02,68.52
  Top 0.254: IC20.8 164.71,77.28 v165.44,76.54 | v183.94,64.35 185.4,64.35 IC6.20 | R60.2 R44.2
  Top 0.406: IC17.4 21.37,120.53 v20.36,119.52 | C68.1 176.11,83.55 176.11,84.37 177.23,85.48 177.23,86.2 IC10.27 177.23,86.4 177.23,89.96 | R50.2 177.13,109.87 176.01,108.75 176.01,102.45 IC10.42 175.81,102.35 175.81,92.7 177.23,91.28 177.23,89.96 | 117.79,108.85 116.88,107.94 116.88,103.87 116.37,103.37 116.37,102.55 IC12.42 116.27,102.35 116.27,94.63 115.86,94.22 115.86,92.8 117.49,91.17 117.49,86.4 IC12.27 | 117.79,108.85 118.81,109.87 118.81,110.07 R66.2 | C13.1 180.38,40.48 180.38,40.68 190.54,50.84 190.54,51.96 C10.2 190.74,52.16 193.59,52.16 196.74,55.31 196.74,58.56 v194.2,61.1 192.77,61.1 IC6.4 | R19.2 137.71,31.74 151.83,31.74 152.13,32.04 R144.2 152.34,32.15 155.89,32.15 R143.2 156,32.25 164.53,40.78 | IC14.4 33.26,89.85 31.84,89.85 v30.42,91.28 29.1,89.96 29.1,88.33 29.81,87.62 30.62,87.62 31.23,88.23 33.26,88.23 IC14.6 | 237.68,108.95 235.95,107.23 235.95,102.45 IC8.42 | 237.68,108.95 238.8,110.07 238.8,110.28 R34.2 | R149.2 29.6,62.73 29.6,65.06 R154.2 29.6,65.27 33.36,69.03 v33.36,69.74 R4.2 | R10.1 177.94,67.2 180.48,67.2 R13.1 180.68,66.99 181.6,66.08 181.6,64.96 182.41,64.15 183.22,64.15 183.43,64.35 v183.94,64.35 | 3.39,34.99 3.39,36.31 C88.1 | R158.2 3.39,34.99 | 3.39,34.99 7.35,34.99 8.17,34.18 9.59,34.18 R160.2 9.59,34.38 9.59,41.9 v13.35,45.56 | IC8.16 222.65,89.24 220.41,87.01 C63.1 220.21,86.4 219.19,85.38 217.56,85.38 P14.1 | R49.2 189.62,108.34 190.23,108.34 191.15,109.26 v193.99,109.26 196.23,109.26 197.14,108.34 R56.2 | IC12.16 104.38,89.35 104.18,89.14 98.79,89.14 C69.1 98.69,89.24 96.15,89.24 93,92.39 P1.1 | 45.15,84.77 45.15,83.45 C67.2
  Top 0.406: 45.15,84.77 42.61,87.31 41.9,87.31 IC14.18 | C66.2 29.91,78.58 v29.91,76.85 29.91,75.02 29.2,74.31 IC11.8 | C5.1 158.64,86.4 | v37.33,98.49 38.24,97.58 38.55,97.58 R52.2 | 99.81,38.44 99.81,36.21 R6.2 | 99.81,38.44 101.03,39.66 R7.2 | R12.2 163.82,69.64 v163.82,70.96 163.82,72.18 164.83,73.19 C14.1 | R167.2 69.23,91.17 v71.36,91.17 73.5,91.17 R166.2 | R139.2 266.84,24.42 267.04,24.42 267.86,25.24 269.58,25.24 270.4,24.42 R137.2 270.5,24.22 v270.5,23.1 | R114.2 266.43,118 266.43,118.2 265.62,119.01 265.62,120.64 266.43,121.45 R110.2 266.64,121.55 v267.75,121.55 | R120.2 207,122.67 207,122.87 206.19,123.69 206.19,125.31 207,126.12 R118.2 v208.32,126.12 | 256.07,39.05 256.07,40.58 R128.2 | 256.07,39.05 256.07,37.43 R133.2 | 227.12,37.02 227.12,37.94 R129.2 | 227.12,37.02 227.12,36.01 R168.1 | v178.45,48.5 179.57,48.5 IC3.5 | v83.05,16.91 84.47,16.91 R8.1 | 164.53,40.78 162.19,43.12 P8.1 | 164.53,40.78 168.8,36.51 168.8,35.09 R15.2 | R150.2 55.72,71.87 55.72,71.67 56.83,70.55 56.83,67.91 59.88,64.86 61.71,64.86 62.93,66.08 JP7.3 | R53.2 60.39,79.59 60.39,76.65 59.88,76.14 59.88,73.6 60.69,72.79 64.15,72.79 JP4.1 | v132.53,76.04 133.95,76.04 C61.1 | v129.58,111.29 129.58,110.17 R65.2 | v137.71,111.29 137.71,110.17 R72.2 | v148.88,123.08 148.48,122.67 R108.2 | R106.2 v148.88,126.12 | v256.27,55.51 256.27,54.19 C78.1 | v152.44,63.95 152.44,62.62 C11.1 | R33.2 v249.26,111.8 | v258,108.85 256.68,108.85 R40.2 | 227.12,37.02 v226,37.02 | v170.22,42.3 171.24,42.3 IC1.8 | IC24.16 36.72,51.14 36.01,51.14 35.19,50.33 35.19,41.29 35.29,41.19 35.6,41.49 40.58,41.49 R165.1 40.58,41.29 40.58,37.02 43.52,34.08 C1.+
  Top 0.406: IC27.16 v253.84,53.79 | v237.28,88.13 237.28,86.3 IC8.27 | v162.19,89.24 IC10.16 | 256.07,39.05 v256.17,39.05 | 99.81,38.44 99.71,38.55 93.92,38.55 93.11,39.36 P2.1 | 45.15,84.77 v45.25,84.77 | 237.68,108.95 v237.38,109.26 | 177.23,89.96 v177.33,89.96 | 129.93,65.21 v130.19,65.47 | C5.1 158.74,86.3 | 117.79,108.85 v117.79,111.29 | R44.2 265.52,84.88 270.6,89.96 P15.1 | 39.97,128.7 v39.97,128.66 39.97,125.57 36.92,122.52 R88.2 36.53,122.5 C65.2 | C23.2 R97.2 33.06,110.67 33.06,106.52 27.01,100.47 v27.01,97.63 21.37,103.27 IC9.4 20.16,108.25 v20.16,107.53 18.63,106.01 C7.2 | C5.1 158.53,86.3 | P13.1 156.71,86.3 158.33,86.3 C5.1 | IC15.5 158.23,83.05 158.53,83.35 158.53,86.09 C5.1
  POWER 0.406: v193.99,109.26 193.99,109.29 | v13.35,45.56 12.74,45 | v237.38,109.26 237.38,109.31
  Bottom 0.406: v20.36,119.52 20.36,107.73 v20.16,107.53
  pour POWER (rank 3): 0.04,98.13 2.12,98.13 17.62,98.13 17.62,105.75 37.17,105.75 37.17,126.33 37.94,126.33 37.94,130.9 275.88,130.9 275.88,0.14 0.04,0.14
A0  (via drill 0.51)
  Top 0.203: IC27.31 235.75,52.57 235.24,53.07 TP45.TP 205.37,53.07 205.32,53.02 | 205.32,53.02 177.03,24.73 177.03,15.58 177.64,14.97 183.94,14.97 184.14,15.18 184.14,16.29 183.22,17.21 DS20.A | IC2.97 136.56,74.69 136.79,74.92 136.79,75.22 137.2,75.63 137.2,78.37 137.81,78.98 v156.71,78.98 | v191.66,75.22 198.36,68.52 200.19,68.52 205.27,63.44 205.27,53.07 205.32,53.02
  Bottom 0.203: v156.71,78.98 166.66,88.94 167.48,88.94 167.88,88.53 167.88,87.62 164.94,84.67 164.94,84.06 167.17,81.83 185.05,81.83 v191.66,75.22
A0/6  (via drill 0.51)
  Top 0.203: IC11.3 23.81,71.67 19.04,71.67 R9.1 18.94,71.67 15.28,71.67 12.54,74.41 12.54,94.43 13.15,95.04 21.88,95.04 23.2,96.36 27.67,96.36 28.49,97.17 28.49,98.79 30.01,100.32 32.45,100.32 36.82,104.69 39.97,104.69 v42.91,101.74 | v43.32,92.29 42.41,91.38 41.9,91.38 IC14.23
  Bottom 0.203: v43.32,92.29 43.32,101.33 v42.91,101.74
A1  (via drill 0.51)
  Top 0.203: 249.06,35.8 249.06,40.48 248.96,40.58 IC27.5 | 186.22,29.55 186.37,29.71 188.2,29.71 190.74,32.25 196.23,32.25 198.36,34.38 239.51,34.38 240.93,35.8 249.06,35.8 | 186.22,29.55 185.87,29.2 185.87,25.64 178.45,18.23 178.45,17.92 DS19.A | 249.06,35.8 TP46.TP | IC2.96 137.06,74.47 137.2,74.61 137.81,74.61 v138.52,73.9 | v138.52,67.3 138.52,60.39 134.86,56.73 134.76,56.73 134.56,56.53 134.56,43.73 145.02,33.26 v155.59,33.26 | v185.66,32.15 185.66,30.11 186.22,29.55
  GND 0.203: v138.52,67.3 v138.52,73.9
  Bottom 0.203: v155.59,33.26 184.55,33.26 v185.66,32.15
A1/6  (via drill 0.51)
  Top 0.203: IC11.2 24.52,72.99 27.98,69.53 31.33,69.53 32.35,70.55 32.35,71.36 33.36,72.38 R4.1 33.36,72.79 33.57,72.99 v33.57,78.78 | v39.36,90.67 40.78,92.09 41.8,92.09 IC14.24
  Bottom 0.203: v39.36,90.67 39.36,90.06 38.34,89.04 38.34,83.55 v33.57,78.78
A2  (via drill 0.51, 0.6)
  Top 0.203: 228.84,39.16 228.84,37.94 R129.1 | 228.84,39.16 228.84,39.87 TP44.TP 222.65,46.06 v199.58,46.06 | 228.84,39.16 237.99,39.16 238.8,39.97 IC27.41 | IC2.95 137.56,73.09 139.23,73.09 139.43,73.29 139.43,76.75 139.64,76.95 141.06,76.95 141.26,76.75 141.26,75.33 v140.75,74.82 | v160.36,56.43 163.21,56.43 169.51,50.13 169.51,50.03 173.47,46.06 v180.18,46.06
  GND 0.203: v160.36,56.43 158.23,56.43 154.57,60.09 154.57,60.29 145.33,69.53 145.33,69.84 140.75,74.41 v140.75,74.82
  Bottom 0.203: v199.58,46.06 v180.18,46.06
A2/6  (via drill 0.51)
  Top 0.203: 214.31,29.91 214.31,26.66 Q8.4 | v55.82,89.75 50.13,89.75 45.25,94.63 42.1,94.63 41.19,93.71 40.37,93.71 IC14.25 | v68.31,82.03 80.51,82.03 v96.25,66.28 | v212.89,31.33 214.31,29.91 | 214.31,29.91 R100.2
  Bottom 0.203: v55.82,89.75 60.59,89.75 v68.31,82.03 | v96.25,66.28 96.25,62.32 116.88,41.7 142.28,41.7 143.19,40.78 143.19,40.17 152.03,31.33 v212.89,31.33
A3
  Top 0.203: R11.2 139.84,75.49 139.84,73.09 139.43,72.68 138.22,72.68 138.06,72.53 IC2.94
A6/6  (via drill 0.51)
  Top 0.203: v46.77,86.3 44.95,88.13 41.9,88.13 IC14.19 | v48.3,84.77 48.3,82.74 61.2,69.84 64.35,69.84 65.47,68.72 JP7.6
  Bottom 0.203: v46.77,86.3 v48.3,84.77
A7/6
  Top 0.203: IC14.22 41.8,90.57 40.48,90.57 39.56,89.65 38.95,89.65 38.55,89.24 38.55,88.43 42.41,84.57 43.42,84.57 44.44,83.55 44.44,82.74 53.28,73.9 55.72,73.9 59.27,70.35 59.27,68.21 60.19,67.3 64.35,67.3 65.47,66.18 JP7.5
A/3  (via drill 0.58)
  Top 0.61: v246.22,83.05 245.3,82.13 IC21.3 | R31.1 254.14,86.6 259.83,86.6 260.95,87.72 X5.1 | v226.81,100.52 225.79,101.54 225.79,102.35 IC8.6
  Bottom 0.61: X5.1 260.95,87.72 256.27,83.05 v246.22,83.05 246.01,83.25 244.29,83.25 227.01,100.52 v226.81,100.52
A/4  (via drill 0.58)
  Top 0.61: v186.17,83.25 185.26,82.34 IC22.3 | R47.1 193.18,86.91 194.3,88.03 203.14,88.03 203.34,87.82 X6.1 | v167.58,99.2 165.85,100.93 165.85,102.35 IC10.6
  Bottom 0.61: X6.1 203.34,87.72 198.87,83.25 v186.17,83.25 185.97,83.45 181.8,83.45 181.09,84.16 181.09,84.67 167.58,98.19 v167.58,99.2
A/5  (via drill 0.58)
  Top 0.61: IC23.3 125.52,82.13 125.52,82.44 127.95,84.88 133.64,84.88 R63.1 136.28,87.31 142.79,87.31 143.19,87.72 X7.1 | v107.84,99.3 106.21,100.93 106.21,102.45 IC12.6
  Bottom 0.61: v107.84,99.3 107.84,98.79 120.54,86.09 120.54,85.28 121.25,84.57 140.04,84.57 143.19,87.72 X7.1
A/8  (via drill 0.58)
  Top 0.61: v227.22,68.21 227.22,66.99 IC28.3 | v233.21,71.87 234.63,71.87 R126.1 | v249.97,42.71 250.18,42.51 250.18,40.68 IC27.6
  Bottom 0.61: 227.22,71.87 227.22,74.61 X13.1 | 227.22,71.87 v227.22,68.21 | 227.22,71.87 v233.21,71.87 233.41,71.67 233.41,59.68 249.97,43.12 v249.97,42.71
A/9  (via drill 0.58)
  Top 0.61: 68.87,51.4 70.85,49.42 X14.1 | 68.87,51.4 65.06,55.21 64.45,55.21 IC29.3 | R147.1 64.25,46.77 68.87,51.4 | v39.56,62.42 38.55,63.44 IC24.6
  Bottom 0.61: X14.1 70.85,49.42 65.06,49.42 61.91,52.57 48.5,52.57 39.66,61.41 39.66,62.32 v39.56,62.42
APWR  (via drill 0.58, 0.6 pad 0)
  Top 0.61: v49.01,101.44 47.38,99.81 DS23.C
  Bottom 0.61: v49.01,101.44 49.01,105.75 | 48.3,116.17 48.3,118.3 X19.1
  other vias: 56.22,115.41 54.95,115.41 53.68,115.41 52.41,115.41 51.14,115.41 49.87,115.41 48.6,115.41 47.33,115.41 46.06,115.41 46.06,114.14 47.33,114.14 48.6,114.14 49.87,114.14 51.14,114.14 52.41,114.14 53.68,114.14 54.95,114.14 56.22,114.14 56.22,112.87 54.95,112.87 53.68,112.87 52.41,112.87 51.14,112.87 49.87,112.87 48.6,112.87 47.33,112.87 46.06,112.87 46.06,111.6 47.33,111.6 48.6,111.6 49.87,111.6 51.14,111.6 52.41,111.6 53.68,111.6 54.95,111.6 56.22,111.6 56.22,110.33 54.95,110.33 53.68,110.33 52.41,110.33 51.14,110.33 49.87,110.33 48.6,110.33 47.33,110.33 46.06,110.33 46.06,109.06 47.33,109.06 54.95,109.06 56.22,109.06 56.22,107.79 54.95,107.79 47.33,107.79 46.06,107.79 46.06,106.52 47.33,106.52 54.95,106.52 56.22,106.52
  pour Bottom (no thermals): 45.3,116.17 56.99,116.17 56.99,105.75 45.3,105.75
  pour Top (no thermals): 45.3,116.17 56.99,116.17 56.99,105.75 45.3,105.75
  pour POWER (no thermals): 45.3,116.17 56.99,116.17 56.99,105.75 45.3,105.75
APWR1  (via drill 0.6, 0.6 pad 0)
  Top 0.406: 223.56,28.69 222.24,28.69 v221.53,29.4
  Top 0.61: 223.56,28.69 DS29.C | X15.1 231.89,12.43 231.89,14.57
  Bottom 0.406: v221.53,29.4 222.24,29.4 223.36,28.28 v223.36,24.22
  other vias: 223.36,15.33 224.63,15.33 225.9,15.33 227.17,15.33 228.44,15.33 229.71,15.33 230.98,15.33 232.25,15.33 233.52,15.33 223.36,16.6 223.36,17.87 223.36,19.14 223.36,20.41 223.36,21.68 223.36,22.95 224.63,24.22 224.63,22.95 224.63,21.68 224.63,20.41 224.63,19.14 224.63,17.87 224.63,16.6 225.9,16.6 227.17,16.6 228.44,16.6 229.71,16.6 230.98,16.6 232.25,16.6 233.52,16.6 233.52,17.87 233.52,19.14 233.52,20.41 233.52,21.68 233.52,22.95 233.52,24.22 232.25,24.22 232.25,22.95 232.25,21.68 232.25,20.41 232.25,19.14 232.25,17.87 230.98,17.87 229.71,17.87 228.44,17.87 227.17,17.87 225.9,17.87 225.9,19.14 227.17,19.14 228.44,19.14 229.71,19.14 230.98,19.14 230.98,20.41 229.71,20.41 228.44,20.41 227.17,20.41 225.9,20.41
  pour Top (no thermals): 234.28,24.98 234.28,14.57 222.59,14.57 222.59,24.98
  pour POWER: 234.28,24.98 234.28,14.57 222.59,14.57 222.59,24.98
  pour Bottom: 234.28,24.98 234.28,14.57 222.59,14.57 222.59,24.98
AREF
  Top 0.203: IC2.98 136.06,75.98 C4.1
ATGND
  pour Top: 36.41,130.39 8.22,130.39 8.22,122.77 0.34,122.77 0.34,98.64 17.11,98.64 17.11,106.26 36.41,106.26
ATX_3V3
  Top 0.203: 78.63,15.94 73.5,21.07 66.49,21.07 X1.1 66.38,21.17 62.32,21.17 X1.2 | 78.63,15.94 81.01,13.55 84.47,13.55 R5.1 | U$13.4 111.49,31.43 111.49,30.21 102.76,21.48 84.16,21.48 78.63,15.94
B/3
  Top 0.61: IC21.1 243.37,82.03 243.37,81.52 243.78,81.12 246.42,81.12 251.3,85.99 251.3,88.03 253.63,90.36 253.63,90.77 DS8.A 253.73,90.97 253.73,91.78 | 253.73,91.78 253.73,93.41 DS7.C 253.53,93.61 252.21,94.93 245.5,94.93 243.88,96.56 243.88,99.81 241.34,102.35 238.49,102.35 IC8.40 | X5.2 260.95,91.78 253.73,91.78
B/4
  Top 0.61: IC22.1 183.33,82.23 183.33,81.62 183.73,81.22 186.07,81.22 192.16,87.31 192.16,87.62 194.4,89.85 194.5,89.85 195.62,90.97 DS12.A 195.72,91.28 195.72,91.78 | 195.72,91.78 195.72,93.92 DS11.C 195.52,94.12 194.5,95.14 193.89,95.14 192.27,96.76 190.03,96.76 184.44,102.35 178.55,102.35 IC10.40 | X6.2 203.34,91.78 195.72,91.78
B/5
  Top 0.61: IC23.1 123.59,82.13 123.59,82.95 122.77,83.76 122.77,85.69 126.12,89.04 129.07,89.04 129.48,89.45 134.56,89.45 136.08,90.97 DS16.A 136.18,91.28 136.18,91.89 | 136.18,91.89 136.18,93.92 DS15.C | IC12.40 118.91,102.45 122.47,102.45 122.98,101.94 126.02,101.94 130.7,106.62 141.06,106.62 146.85,100.83 146.85,93.51 145.02,91.68 143.25,91.68 X7.2 142.99,91.89 136.18,91.89
B/8  (via drill 0.58)
  Top 0.61: 229.25,72.28 229.25,66.99 IC28.1 | 229.25,72.28 234.63,77.66 DS32.C 234.84,77.87 237.38,77.87 DS33.A | v234.63,41.29 235.24,40.68 237.48,40.68 IC27.40 | 229.25,72.28 229.05,72.48 225.39,72.48 X13.2
  Bottom 0.61: v234.63,41.29 234.63,55.61 221.22,69.03 X13.2
B/9  (via drill 0.58)
  Top 0.61: IC24.40 51.25,64.25 53.48,64.25 55.11,62.62 57.55,62.62 59.68,60.49 DS36.C 62.93,60.69 65.37,63.13 72.89,63.13 74,62.02 74,56.43 70.96,53.38 X14.2 | 62.52,53.28 62.52,50.33 62.73,50.13 DS37.A | 62.52,53.28 62.52,55.21 IC29.1 | v62.73,53.28 62.52,53.28
  Bottom 0.61: v62.73,53.28 70.85,53.28 X14.2
BPWR  (via drill 0.58, 0.6)
  Top 0.61: v61.2,100.67 59.58,99.81 DS24.C | 60.49,116.17 60.49,118.3 X17.1
  Bottom 0.61: v61.2,100.67 61.2,105.75
  other vias: 58.26,115.41 59.53,115.41 60.8,115.41 62.07,115.41 63.34,115.41 64.61,115.41 65.88,115.41 67.15,115.41 68.42,115.41 68.42,114.14 67.15,114.14 65.88,114.14 64.61,114.14 63.34,114.14 62.07,114.14 60.8,114.14 59.53,114.14 58.26,114.14 58.26,112.87 59.53,112.87 60.8,112.87 62.07,112.87 63.34,112.87 64.61,112.87 65.88,112.87 67.15,112.87 68.42,112.87 68.42,111.6 67.15,111.6 65.88,111.6 64.61,111.6 63.34,111.6 62.07,111.6 60.8,111.6 59.53,111.6 58.26,111.6 58.26,110.33 59.53,110.33 60.8,110.33 62.07,110.33 63.34,110.33 64.61,110.33 65.88,110.33 67.15,110.33 68.42,110.33 58.26,109.06 59.53,109.06 58.26,107.79 59.53,107.79 58.26,106.52 59.53,106.52 67.15,109.06 68.42,109.06 68.42,107.79 67.15,107.79 67.15,106.52 68.42,106.52
  pour Top (no thermals): 57.49,116.17 69.18,116.17 69.18,105.75 57.49,105.75
  pour Bottom (no thermals): 57.49,116.17 69.18,116.17 69.18,105.75 57.49,105.75
  pour POWER (no thermals): 57.49,116.17 69.18,116.17 69.18,105.75 57.49,105.75
BPWR1  (via drill 0.6, 0.6 pad 0)
  Top 0.406: 211.47,28.69 210.05,28.69 v209.44,29.3
  Top 0.61: 211.47,28.69 DS30.C | X12.1 219.39,12.43 219.39,14.57
  Bottom 0.406: v209.44,29.3 209.74,29.3 211.16,27.88 v211.16,24.22
  other vias: 211.16,15.33 211.16,16.6 211.16,17.87 211.16,19.14 211.16,20.41 211.16,21.68 211.16,22.95 212.43,24.22 212.43,22.95 212.43,21.68 212.43,20.41 212.43,19.14 212.43,17.87 212.43,16.6 212.43,15.33 213.7,15.33 214.97,15.33 216.24,15.33 217.51,15.33 218.78,15.33 220.05,15.33 221.32,15.33 221.32,16.6 220.05,16.6 218.78,16.6 217.51,16.6 216.24,16.6 214.97,16.6 213.7,16.6 213.7,17.87 214.97,17.87 216.24,17.87 217.51,17.87 218.78,17.87 220.05,17.87 221.32,17.87 221.32,19.14 220.05,19.14 218.78,19.14 217.51,19.14 216.24,19.14 214.97,19.14 213.7,19.14 213.7,20.41 214.97,20.41 216.24,20.41 217.51,20.41 218.78,20.41 220.05,20.41 221.32,20.41 221.32,21.68 221.32,22.95 221.32,24.22 220.05,24.22 220.05,22.95 220.05,21.68
  pour Top (no thermals): 222.09,24.98 222.09,14.57 210.4,14.57 210.4,24.98
  pour POWER: 222.09,24.98 222.09,14.57 210.4,14.57 210.4,24.98
  pour Bottom: 222.09,24.98 222.09,14.57 210.4,14.57 210.4,24.98
C/3  (via drill 0.58)
  Top 0.61: 247.64,92.29 247.64,91.17 DS9.C 247.54,90.87 247.54,89.75 243.37,85.59 243.37,84.47 IC21.6 243.07,84.47 226.61,84.47 225.79,85.28 225.79,86.2 IC8.18 | 247.64,92.29 247.64,93.51 DS10.A | 247.64,92.29 v248.55,92.29
  Bottom 0.61: v248.55,92.29 250.48,92.29 253.84,95.65 260.95,95.65 X5.3
C/4  (via drill 0.58)
  Top 0.61: v165.85,84.37 165.85,86.2 IC10.18 | v177.53,84.37 179.16,84.37 180.07,83.45 182.61,83.45 183.33,84.16 183.33,84.27 IC22.6 183.33,84.57 183.33,85.99 188.2,90.87 DS13.C 188.3,91.17 188.3,93.82 DS14.A 188.51,94.02 190.13,95.65 v191.86,95.65
  Bottom 0.61: v177.53,84.37 v165.85,84.37 | v191.86,95.65 203.34,95.65 X6.3
C/5  (via drill 0.58)
  Top 0.61: v125.62,87.01 125.31,87.01 123.69,85.38 123.69,84.47 IC23.6 | v125.92,90.16 126.73,90.16 127.45,90.87 DS17.C 127.55,91.17 127.55,93.82 DS18.A 127.65,94.02 129.27,95.65 143.19,95.65 X7.3 | v113.73,94.53 113.43,94.53 106.21,87.31 106.21,86.4 IC12.18
  Bottom 0.61: v125.62,87.01 125.62,89.85 v125.92,90.16 125.41,90.06 118.2,90.06 v113.73,94.53
C/8
  Top 0.61: 240.93,76.14 242.25,77.46 DS34.C 242.56,77.56 244.69,77.56 DS35.A 245,77.36 254.24,68.11 254.24,61.81 250.28,57.85 250.28,56.83 IC27.18 | 240.93,76.14 229.55,64.76 229.25,64.76 IC28.6 | X13.3 217.36,76.65 220.51,79.8 228.84,79.8 229.86,78.78 238.29,78.78 240.93,76.14
C/9  (via drill 0.58)
  Top 0.61: 60.8,57.65 62.42,57.65 IC29.6 | 60.8,57.65 58.15,60.29 DS39.A | 57.95,51.45 57.95,51.75 60.59,54.39 60.59,55.41 | 57.95,51.45 57.95,50.03 DS38.C | 60.59,55.41 60.59,57.44 60.8,57.65 | v39.56,50.03 38.55,49.01 IC24.18 | v57.44,51.45 57.95,51.45 | 60.59,55.41 v60.9,55.41
  Bottom 0.61: v39.56,50.03 42.61,50.03 43.12,49.52 55.51,49.52 v57.44,51.45 | v60.9,55.41 62.32,55.41 64.15,57.24 70.85,57.24 X14.3
CPWR  (via drill 0.58, 0.6)
  Top 0.61: v73.09,101.13 71.77,99.81 DS25.C | X16.1 72.58,118.3 72.58,116.17
  Bottom 0.61: v73.09,101.13 77.66,105.7 77.66,105.75
  other vias: 70.45,115.41 71.72,115.41 72.99,115.41 74.26,115.41 75.53,115.41 76.8,115.41 78.07,115.41 79.34,115.41 80.61,115.41 80.61,114.14 79.34,114.14 78.07,114.14 76.8,114.14 75.53,114.14 74.26,114.14 72.99,114.14 71.72,114.14 70.45,114.14 70.45,112.87 71.72,112.87 72.99,112.87 74.26,112.87 75.53,112.87 76.8,112.87 78.07,112.87 79.34,112.87 80.61,112.87 80.61,111.6 79.34,111.6 78.07,111.6 76.8,111.6 75.53,111.6 74.26,111.6 72.99,111.6 71.72,111.6 70.45,111.6 70.45,110.33 71.72,110.33 72.99,110.33 74.26,110.33 75.53,110.33 76.8,110.33 78.07,110.33 79.34,110.33 80.61,110.33 70.45,109.06 71.72,109.06 71.72,107.79 71.72,106.52 70.45,106.52 70.45,107.79 79.34,109.06 79.34,107.79 79.34,106.52 80.61,109.06 80.61,107.79 80.61,106.52
  pour Bottom (no thermals): 69.69,116.17 81.37,116.17 81.37,105.75 69.69,105.75
  pour Top (no thermals): 69.69,116.17 81.37,116.17 81.37,105.75 69.69,105.75
  pour POWER (no thermals): 69.69,116.17 81.37,116.17 81.37,105.75 69.69,105.75
CPWR1  (via drill 0.6, 0.6 pad 0)
  Top 0.406: DS31.C 197.28,28.76 v196.64,29.1
  Top 0.61: X11.1 207.2,12.43 207.2,14.57
  Bottom 0.406: v198.97,24.22 198.97,27.06 v196.64,29.1
  other vias: 204.05,15.33 202.78,15.33 201.51,15.33 200.24,15.33 198.97,15.33 205.32,15.33 206.59,15.33 207.86,15.33 209.13,15.33 198.97,16.6 198.97,17.87 198.97,19.14 198.97,20.41 198.97,21.68 198.97,22.95 200.24,24.22 200.24,22.95 200.24,21.68 200.24,20.41 200.24,19.14 200.24,17.87 200.24,16.6 209.13,16.6 209.13,17.87 209.13,19.14 209.13,20.41 209.13,21.68 209.13,22.95 209.13,24.22 207.86,24.22 207.86,22.95 207.86,21.68 207.86,20.41 207.86,19.14 207.86,17.87 207.86,16.6 201.51,16.6 202.78,16.6 204.05,16.6 205.32,16.6 206.59,16.6 206.59,17.87 205.32,17.87 204.05,17.87 202.78,17.87 201.51,17.87 201.51,19.14 202.78,19.14 204.05,19.14 205.32,19.14 206.59,19.14 206.59,20.41 205.32,20.41 204.05,20.41 202.78,20.41 201.51,20.41
  pour Top (no thermals): 209.89,24.98 209.89,14.57 198.21,14.57 198.21,24.98
  pour POWER: 209.89,24.98 209.89,14.57 198.21,14.57 198.21,24.98
  pour Bottom (isolate 0.254): 209.89,24.98 209.89,14.57 198.21,14.57 198.21,24.98
CTS
  Top 0.203: IC6.11 192.77,65.67 198.77,65.67 199.38,66.28 X3.1
D0  (via drill 0.6)
  Top 0.203: IC2.2 143.06,69.09 v143.6,69.64 | v156,83.05 156.61,83.66 157.62,83.66 IC15.4
  Bottom 0.203: v156,83.05 155.59,83.05 148.99,76.44 148.99,73.39 146.75,71.16 146.34,71.16 144.82,69.64 v143.6,69.64
D1  (via drill 0.6)
  Top 0.203: v156.91,76.24 156.91,73.7 155.49,72.28 148.78,72.28 148.07,71.57 148.07,70.25 147.46,69.64 147.46,68.72 146.24,67.5 144.51,67.5 143.43,68.59 IC2.3 | IC20.2 168.24,77.82 168.8,78.37 v168.8,79.39
  Bottom 0.203: v168.8,79.39 167.17,77.76 163.92,77.76 162.4,76.24 v156.91,76.24
D2  (via drill 0.51)
  Top 0.203: TP1.TP 93,103.67 93,100.12 P1.4 | v134.56,67.09 133.14,67.09 IC2.6
  Bottom 0.203: v134.56,67.09 132.02,67.09 128.66,70.45 128.66,82.03 126.73,83.96 109.06,83.96 93,100.01 P1.4
D2/6  (via drill 0.6)
  Top 0.203: IC9.6 26.6,110.71 31.32,110.71 R97.1 31.45,108.87 v31.23,108.65 | v33.77,95.85 33.77,94.65 IC14.32
  Bottom 0.203: v31.23,108.65 31.23,98.39 v33.77,95.85
D3/6
  Top 0.203: 53.28,103.87 53.07,104.08 Q3.4 53.28,103.87 | 53.28,103.87 53.28,100.73 R90.2 53.18,100.73 49.72,97.27 44.23,97.27 41.49,100.01 41.49,102.55 39.77,104.28 38.14,104.28 32.86,99 32.86,95.54 33.26,95.14 IC14.1
D4  (via drill 0.51)
  Top 0.203: IC24.31 53.07,52.36 53.68,52.36 54.39,51.65 56.02,51.65 TP53.TP 56.12,51.55 56.93,50.74 56.93,49.52 60.59,45.86 70.96,45.86 76.44,51.35 76.44,67.7 | 76.44,67.7 76.44,74.92 75.43,75.93 75.43,76.24 DS27.A | v113.83,67.09 115.97,69.23 127.75,69.23 128.16,69.64 133.03,69.64 IC2.1 | v87.01,67.09 84.57,67.09 83.96,67.7 76.44,67.7
  Bottom 0.203: v87.01,67.09 v113.83,67.09
D4/6  (via drill 0.6)
  Top 0.203: v23.91,119.11 24.02,119.22 24.02,121.45 25.08,122.52 IC17.6 R88.1 | v30.11,93 31.74,91.38 IC14.2
  Bottom 0.203: v23.91,119.11 23.91,103.16 30.01,97.07 30.01,93.11 v30.11,93
D5  (via drill 0.51)
  Top 0.203: 37.68,67.04 39.77,64.96 39.77,64.35 IC24.5 | 37.68,67.04 36.31,68.42 36.01,68.42 TP54.TP | v65.06,70.55 70.45,75.93 DS26.A | 37.68,67.04 v38.65,68.01 | v97.47,59.88 118.61,59.88 126.33,67.6 133.03,67.6 IC2.5
  Bottom 0.203: v38.65,68.01 52.87,68.01 55.41,70.55 v65.06,70.55 65.27,70.55 68.31,67.5 76.24,67.5 82.54,61.2 93.92,61.2 95.24,59.88 v97.47,59.88
D5/6  (via drill 0.51)
  Top 0.203: 226.51,29.91 226.51,26.66 Q7.4 | v57.75,69.74 57.75,71.26 55.51,73.5 53.07,73.5 47.38,79.19 45.45,79.19 45.15,78.88 45.15,77.76 44.64,77.26 43.63,77.26 43.22,77.66 35.6,77.66 35.19,78.07 35.19,78.98 33.97,80.2 33.97,83.86 34.69,84.57 34.69,85.08 IC14.9 | v224.78,29.91 226.51,29.91 | 226.51,29.91 R99.2
  Bottom 0.203: v57.75,69.74 60.19,67.3 67.91,67.3 71.87,63.34 79.8,63.34 109.46,33.67 109.46,29.81 109.87,29.4 120.74,29.4 121.65,30.32 187.9,30.32 188.51,30.93 212.08,30.93 212.49,30.52 219.39,30.52 219.9,31.03 223.66,31.03 v224.78,29.91
D6  (via drill 0.51)
  Top 0.203: R150.1 55.61,70.04 54.09,68.52 53.07,68.52 TP52.TP 52.97,68.52 50.03,65.57 50.03,64.35 IC24.41 49.92,64.25 49.62,63.95 49.62,52.06 50.64,51.04 50.64,45.05 51.55,44.13 69.84,44.13 80.71,55 114.95,55 120.23,60.29 v127.55,60.29 | IC2.15 129.87,62.59 129.66,62.8 | 129.66,62.8 129.38,63.08 | v129.88,62.93 129.78,62.83 129.68,62.83 129.66,62.8
  GND 0.203: v129.88,62.93 129.88,62.62 v127.55,60.29
D6/6  (via drill 0.51)